# EAGLE design Independent_Assignment (EAGLE 6.5.0)
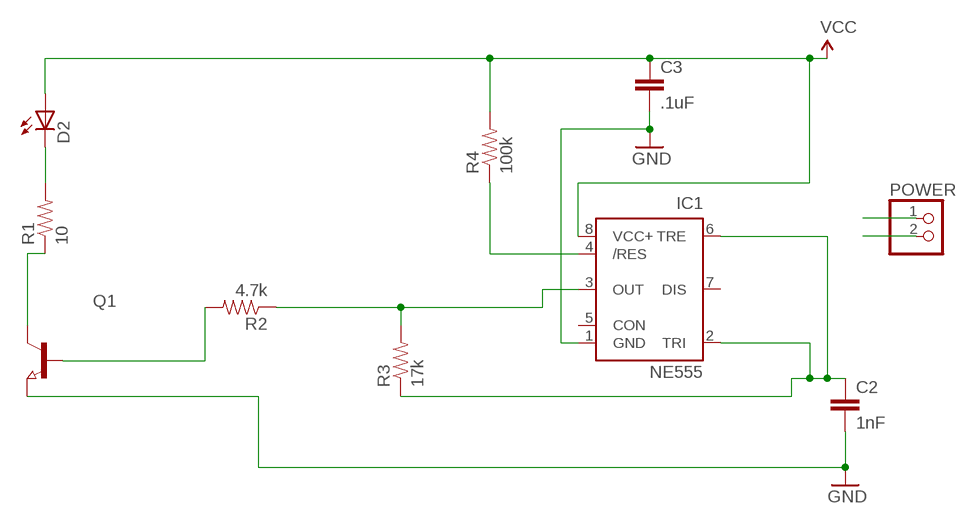
[diagram p0: schematic, sheet 1]

## Parts
C2  1nF  CAP0603-CAP  [0603-CAP]
C3  .1uF  CAP0603-CAP  [0603-CAP]
D2  SFH482  [SFH482]
IC1  NE555  [DIL-08]
POWER  PINHD-1X2  [1X02]
Q1  NPN-TRANSISTOR_SOT23W  [SOT23W]
R1  10  RESISTOR0603-RES  [0603-RES]
R2  4.7k  RESISTOR0603-RES  [0603-RES]
R3  17k  RESISTOR0603-RES  [0603-RES]
R4  100k  RESISTOR0603-RES  [0603-RES]

## Nets
GND: C2.2 C3.2 IC1.1(GND) POWER.2 Q1.3(E)
N$1: C2.1 IC1.2(TRI) IC1.6(TRE) R3.1
N$2: D2.K(C) R1.2
N$3: Q1.2(C) R1.1
N$4: Q1.1(B) R2.2
N$5: IC1.3(OUT) R2.1 R3.2
N$6: IC1.4(/RES) R4.1
VCC: C3.1 D2.A IC1.8(VCC+) POWER.1 R4.2
Unconnected: IC1.5(CON) IC1.7(DIS)

## Library data of the parts
C2 C3 = beacon_board:CAP: Capacitor Standard 0603 ceramic capacitor, and 0.1" leaded capacitor.
D2 = led:SFH482: IR LED infrared emitting diode, Infineon
IC1 = st-microelectronics:NE555: General purpose bipolar Timer; MF: Arrow Electronics; MPN: NE555N; OC_FARNELL: 1467742; OC_NEWARK: 89K1486
POWER = pinhead:PINHD-1X2: PIN HEADER
Q1 = semicon-smd-ipc:NPN-TRANSISTOR_: NPN TRANSISTOR
R1-R4 = beacon_board:RESISTOR: Resistor Basic schematic elements and footprints for 0603, 1206, and PTH resistors.

## Board
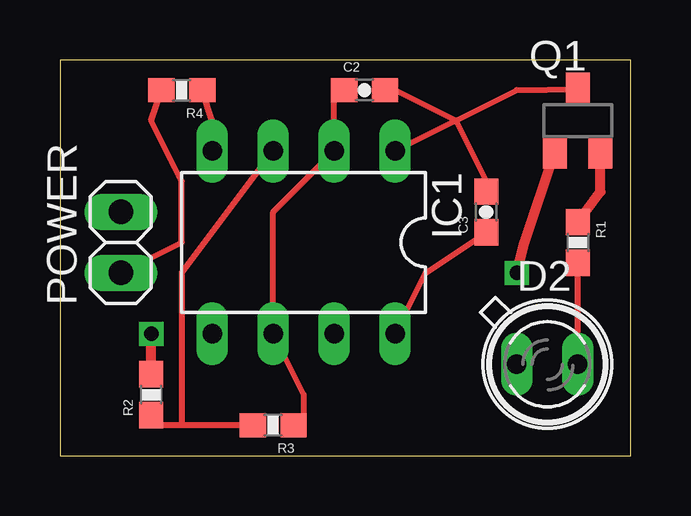
[diagram p1: board, top side]
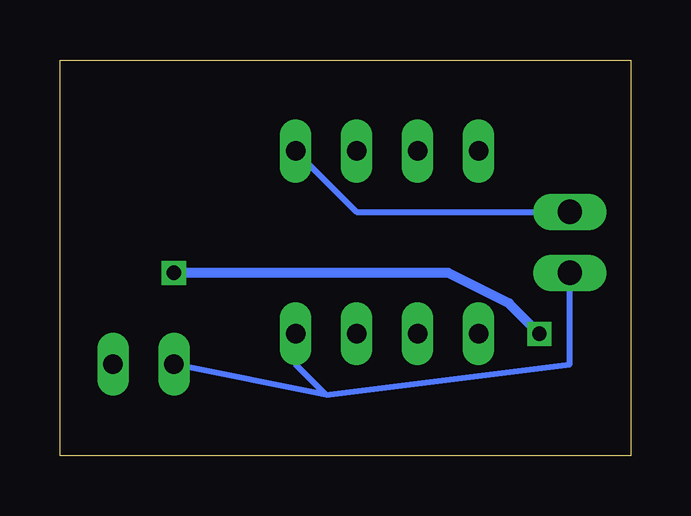
[diagram p2: board, bottom side, seen from below]

Size 23.8 x 16.5 mm. Coordinates in mm from the lower left corner, seen from the top.
Outline: 0,0 23.8,0 23.8,16.5 0,16.5 0,0
Copper layers (1*16): Top 0.035mm / dielectric 1.5mm / Bottom 0.035mm
Design rules "default": minimum track width 10mil, minimum drill 24mil, track to track 8mil, track to pad 8mil, pad to pad 8mil, via to via 8mil, smd to smd 8mil, copper to edge 40mil, drill to drill 8mil, minimum pad ring 10mil, minimum via ring 8mil, stop-mask expansion 4mil, vias tented up to drill 0mil, thermal gap 10mil

### Footprints (pad centres in the part's own frame; a part is rotated, then mirrored left to right if it is on the bottom)
0603-CAP = smd 1.1 x 1: 1 -0.85,0; 2 0.85,0
SFH482 = drill 0.813 long: A -1.27,0; K 1.27,0
DIL-08 = drill 0.813 long: 1 -3.81,-3.81; 2 -1.27,-3.81; 3 1.27,-3.81; 4 3.81,-3.81; 5 3.81,3.81; 6 1.27,3.81; 7 -1.27,3.81; 8 -3.81,3.81
1X02 = drill 1.016 long: 1 -1.27,0; 2 1.27,0
SOT23W = smd 1 x 1.4: 1 -0.95,-1.303; 2 0.95,-1.303; 3 0,1.303
0603-RES = smd 1.1 x 1: 1 -0.85,0; 2 0.85,0

### Placement (x,y rotation side)
C2  12.7,15.24 0 top
C3  17.78,10.16 90 top
D2  20.32,3.81 0 top
IC1  10.16,8.89 180 top
POWER  2.54,8.89 90 top
Q1  21.59,13.97 0 top
R1  21.59,8.89 270 top
R2  3.81,2.54 90 top
R3  8.89,1.27 180 top
R4  5.08,15.24 180 top

### Tracks (layer width: path | path; a pad name or v marks a point on that pad's centre or on a via)
GND
  Top 0.254: 16.51,13.97 13.97,15.24 C2.2 | 16.51,13.97 17.78,11.43 C3.2 | 16.51,13.97 19.05,15.24 Q1.3 | 16.51,13.97 IC1.1
  Bottom 0.254: POWER.2 11.43,10.16 IC1.1
N$1
  Top 0.254: R3.1 10.16,1.27 10.16,2.54 IC1.6 8.89,10.16 IC1.2 11.43,15.24 C2.1
N$2
  Top 0.254: D2.K R1.2
N$3
  Top 0.406: R1.1 22.54,11.01 Q1.2
N$4  (via drill 0.6)
  Top 0.406: R2.2 v3.81,5.08 | v19.05,7.62 19.37,8.89 Q1.1
  Bottom 0.406: v3.81,5.08 5.08,6.35 7.62,7.62 v19.05,7.62
N$5
  Top 0.254: IC1.3 5.08,7.62 5.08,1.27 | R3.2 5.08,1.27 | 5.08,1.27 3.81,1.27 R2.1
N$6
  Top 0.254: R4.1 6.35,13.97 IC1.4
VCC
  Top 0.254: POWER.1 5.08,8.89 5.08,11.43 3.81,13.97 R4.2 | IC1.8 15.24,7.62 C3.1
  Bottom 0.254: 12.7,2.54 13.97,3.81 IC1.8 | 12.7,2.54 D2.A | POWER.1 2.54,3.81 12.7,2.54